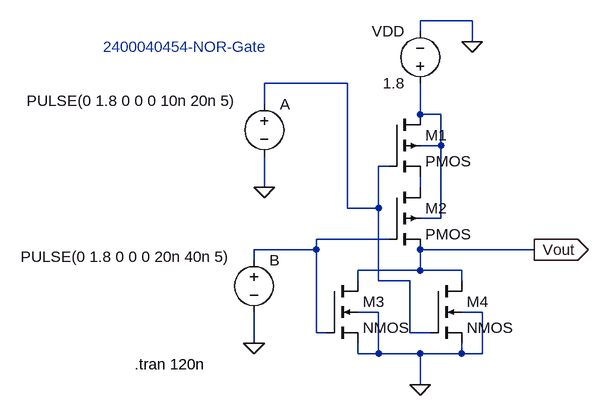
[diagram p0: schematic NOR-schematic-Design.asc]
NOR-schematic-Design.asc, the LTspice schematic file:
Version 4.1
SHEET 1 880 680
WIRE 304 -112 224 -112
WIRE 224 -96 224 -112
WIRE 304 -80 304 -112
WIRE 112 -16 -16 -16
WIRE -16 16 -16 -16
WIRE 224 32 224 -16
WIRE 256 32 224 32
WIRE 256 80 256 32
WIRE 256 80 224 80
WIRE 176 112 160 112
WIRE -16 144 -16 96
WIRE 224 144 224 128
WIRE 112 176 112 -16
WIRE 160 176 160 112
WIRE 160 176 112 176
WIRE 256 192 256 80
WIRE 256 192 224 192
WIRE 176 224 64 224
WIRE 64 240 64 224
WIRE 64 240 -32 240
WIRE 400 240 224 240
WIRE -32 256 -32 240
WIRE 224 272 224 240
WIRE 224 272 128 272
WIRE 288 272 224 272
WIRE 128 288 128 272
WIRE 160 288 160 176
WIRE 208 288 160 288
WIRE 288 288 288 272
WIRE 160 336 128 336
WIRE 320 336 288 336
WIRE 64 368 64 240
WIRE 80 368 64 368
WIRE 208 368 208 288
WIRE 240 368 208 368
WIRE -32 384 -32 336
WIRE 128 400 128 384
WIRE 160 400 160 336
WIRE 160 400 128 400
WIRE 224 400 160 400
WIRE 288 400 288 384
WIRE 288 400 224 400
WIRE 320 400 320 336
WIRE 320 400 288 400
WIRE 224 448 224 400
FLAG 224 448 0
FLAG 304 -80 0
FLAG -32 384 0
FLAG -16 144 0
FLAG 400 240 Vout
IOPIN 400 240 Out
SYMBOL pmos4 176 32 R0
SYMATTR InstName M1
SYMBOL pmos4 176 144 R0
SYMATTR InstName M2
SYMBOL nmos4 80 288 R0
SYMATTR InstName M3
SYMBOL nmos4 240 288 R0
SYMATTR InstName M4
SYMBOL voltage 224 0 R180
WINDOW 0 24 96 Left 2
WINDOW 3 24 16 Left 2
SYMATTR InstName VDD
SYMATTR Value 1.8
SYMBOL voltage -16 0 R0
WINDOW 3 -366 11 Left 2
WINDOW 123 0 0 Left 0
WINDOW 39 0 0 Left 0
SYMATTR InstName A
SYMATTR Value PULSE(0 1.8 0 0 0 10n 20n 5)
SYMBOL voltage -32 240 R0
WINDOW 3 -359 11 Left 2
WINDOW 123 0 0 Left 0
WINDOW 39 0 0 Left 0
SYMATTR InstName B
SYMATTR Value PULSE(0 1.8 0 0 0 20n 40n 5)
TEXT -216 416 Left 2 !.tran 120n
TEXT -264 -72 Left 2 ;2400040454-NOR-Gate

The netlist it stands for:
* NOR-schematic-Design.asc
M1 N002 N001 N003 N002 PMOS
M2 N003 N004 Vout N002 PMOS
M3 Vout N004 0 0 NMOS
M4 Vout N001 0 0 NMOS
VDD N002 0 1.8
V§A N001 0 PULSE(0 1.8 0 0 0 10n 20n 5)
V§B N004 0 PULSE(0 1.8 0 0 0 20n 40n 5)
.model NMOS NMOS
.model PMOS PMOS
.lib standard.mos
.tran 120n
* 2400040454-NOR-Gate
.backanno
.end